# Altium schematic sheet moFOC-MCU.SchDoc
size A4; Organization: Altium Limited; Address1: L3, 12a Rodborough Rd; Address2: Frenchs Forest; Address3: NSW; Address4: Australia 2086
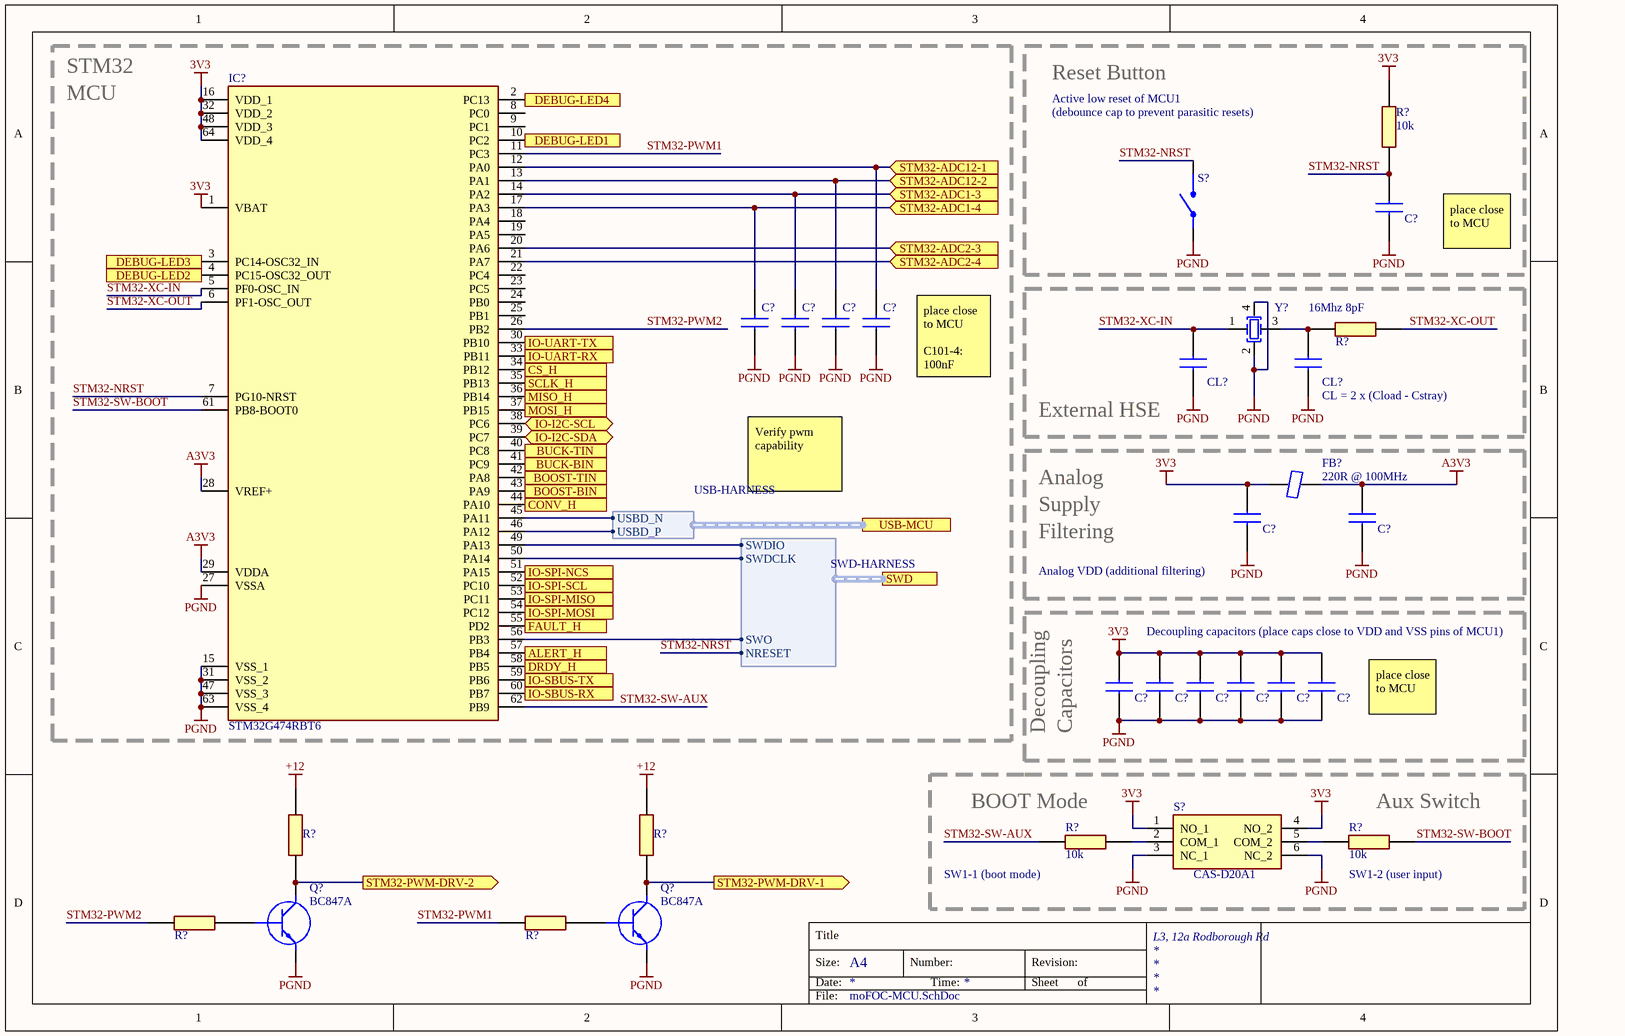
[diagram p0: moFOC-MCU.SchDoc]

## Parts
(Parts that share a designator on the sheet are numbered #1, #2 ... from top to bottom, then left to right.)
C?#1  100nF 3V3  [CAPC1608X97N]  (value not drawn)
C?#2  100nF 6.3V  [CAPC1005X55N]  (value not drawn)
C?#3  100nF 6.3V  [CAPC1005X55N]  (value not drawn)
C?#4  100nF 6.3V  [CAPC1005X55N]  (value not drawn)
C?#5  100nF 6.3V  [CAPC1005X55N]  (value not drawn)
C?#6  10nF  [CAPC1608X97N]  (value not drawn)
C?#7  10nF  [CAPC1608X97N]  (value not drawn)
C?#8  100nF 3V3  [CAPC1608X97N]  (value not drawn)
C?#9  100nF 3V3  [CAPC1608X97N]  (value not drawn)
C?#10  100nF 3V3  [CAPC1608X97N]  (value not drawn)
C?#11  100nF 3V3  [CAPC1608X97N]  (value not drawn)
C?#12  100nF 3V3  [CAPC1608X97N]  (value not drawn)
C?#13  100nF 3V3  [CAPC1608X97N]  (value not drawn)
CL?#1  4nF  [CAPC1608X97N]  (value not drawn)
CL?#2  4nF  [CAPC1608X97N]  (value not drawn)
FB?  220R @ 100MHz  [FB0603]
IC?  STM32G474RBT6  [QFP50P1200X1200X160-64N]
Q?#1  BC847A  [SOT95P230X110-3N]
Q?#2  BC847A  [SOT95P230X110-3N]
R?#1  10k  [RESC1608X50N]
R?#2  22R  [RESC1005X40N]  (value not drawn)
R?#3  10k  [RESC1608X50N]
R?#4  10k  [RESC1608X50N]
R?#5  2k  [RESC1608X50N]  (value not drawn)
R?#6  2k  [RESC1608X50N]  (value not drawn)
R?#7  1k  [RESC1608X50N]  (value not drawn)
R?#8  1k  [RESC1608X50N]  (value not drawn)
S?#1  434153017835  [434153017835]  (value not drawn)
S?#2  CAS-D20A1  [CASD20A1]
Y?  16Mhz 8pF  [ABM8W160000MHZ8B1UT3]

## Blocks framed on the sheet
Reset Button: C?#1 R?#1 S?#1
External HSE: CL?#1 CL?#2 R?#2 Y?

## Ports
ALERT_H (in), BOOST-BIN (out), BOOST-TIN (out), BUCK-BIN (out), BUCK-TIN (out), CONV_H (out), CS_H (out), DEBUG-LED1 (out), DEBUG-LED2 (out), DEBUG-LED3 (out), DEBUG-LED4 (out), DRDY_H (in), FAULT_H (in), IO-I2C-SCL (bidir), IO-I2C-SDA (bidir), IO-SBUS-RX (in), IO-SBUS-TX (out), IO-SPI-MISO (in), IO-SPI-MOSI (out), IO-SPI-NCS (out), IO-SPI-SCL (out), IO-UART-RX (in), IO-UART-TX (out), MISO_H (in), MOSI_H (out), SCLK_H (out), STM32-ADC1-3 (in), STM32-ADC1-4 (in), STM32-ADC2-3 (in), STM32-ADC2-4 (in), STM32-ADC12-1 (in), STM32-ADC12-2 (in), STM32-PWM-DRV-1 (out), STM32-PWM-DRV-2 (out), SWD (harness SWD-HARNESS), USB-MCU (harness USB-HARNESS)

## Harnesses
USB-HARNESS: USBD_P, USBD_N
SWD-HARNESS: SWDIO, SWDCLK, SWO, NRESET

## Nets
3V3: C?#6.1 C?#8.1 C?#9.1 C?#10.1 C?#11.1 C?#12.1 C?#13.1 FB?.1 IC?.1(VBAT) IC?.16(VDD_1) IC?.32(VDD_2) IC?.48(VDD_3) IC?.64(VDD_4) R?#1.1 S?#2.1(NO_1) S?#2.4(NO_2)
+12: R?#5.2 R?#6.2
A3V3: C?#7.1 FB?.2 IC?.28(VREF+) IC?.29(VDDA)
PGND: C?#1.2 C?#2.1 C?#3.1 C?#4.1 C?#5.1 C?#6.2 C?#7.2 C?#8.2 C?#9.2 C?#10.2 C?#11.2 C?#12.2 C?#13.2 CL?#1.1 CL?#2.1 IC?.15(VSS_1) IC?.27(VSSA) IC?.31(VSS_2) IC?.47(VSS_3) IC?.63(VSS_4) Q?#1.2(E) Q?#2.2(E) S?#1.1,3(NO) S?#2.3(NC_1) S?#2.6(NC_2) Y?.2(OSC2) Y?.4
ALERT_H: IC?.57(PB4) ; port ALERT_H
BOOST-BIN: IC?.43(PA9) ; port BOOST-BIN
BOOST-TIN: IC?.42(PA8) ; port BOOST-TIN
BUCK-BIN: IC?.41(PC9) ; port BUCK-BIN
BUCK-TIN: IC?.40(PC8) ; port BUCK-TIN
CONV_H: IC?.44(PA10) ; port CONV_H
CS_H: IC?.34(PB12) ; port CS_H
DEBUG-LED1: IC?.10(PC2) ; port DEBUG-LED1
DEBUG-LED2: IC?.4(PC15-OSC32_OUT) ; port DEBUG-LED2
DEBUG-LED3: IC?.3(PC14-OSC32_IN) ; port DEBUG-LED3
DEBUG-LED4: IC?.2(PC13) ; port DEBUG-LED4
DRDY_H: IC?.58(PB5) ; port DRDY_H
FAULT_H: IC?.55(PD2) ; port FAULT_H
IO-I2C-SCL: IC?.38(PC6) ; port IO-I2C-SCL
IO-I2C-SDA: IC?.39(PC7) ; port IO-I2C-SDA
IO-SBUS-RX: IC?.60(PB7) ; port IO-SBUS-RX
IO-SBUS-TX: IC?.59(PB6) ; port IO-SBUS-TX
IO-SPI-MISO: IC?.53(PC11) ; port IO-SPI-MISO
IO-SPI-MOSI: IC?.54(PC12) ; port IO-SPI-MOSI
IO-SPI-NCS: IC?.51(PA15) ; port IO-SPI-NCS
IO-SPI-SCL: IC?.52(PC10) ; port IO-SPI-SCL
IO-UART-RX: IC?.33(PB11) ; port IO-UART-RX
IO-UART-TX: IC?.30(PB10) ; port IO-UART-TX
MISO_H: IC?.36(PB14) ; port MISO_H
MOSI_H: IC?.37(PB15) ; port MOSI_H
SCLK_H: IC?.35(PB13) ; port SCLK_H
STM32-ADC1-3: C?#3.2 IC?.14(PA2) ; port STM32-ADC1-3
STM32-ADC1-4: C?#2.2 IC?.17(PA3) ; port STM32-ADC1-4
STM32-ADC2-3: IC?.20(PA6) ; port STM32-ADC2-3
STM32-ADC2-4: IC?.21(PA7) ; port STM32-ADC2-4
STM32-ADC12-1: C?#5.2 IC?.12(PA0) ; port STM32-ADC12-1
STM32-ADC12-2: C?#4.2 IC?.13(PA1) ; port STM32-ADC12-2
STM32-NRST: C?#1.1 IC?.7(PG10-NRST) R?#1.2 S?#1.2,4(COM) ; port SWD.NRESET
STM32-PWM1: IC?.11(PC3) R?#8.2
STM32-PWM2: IC?.26(PB2) R?#7.2
STM32-PWM-DRV-1: Q?#2.3(C) R?#6.1 ; port STM32-PWM-DRV-1
STM32-PWM-DRV-2: Q?#1.3(C) R?#5.1 ; port STM32-PWM-DRV-2
STM32-SW-AUX: IC?.62(PB9) R?#3.2
STM32-SW-BOOT: IC?.61(PB8-BOOT0) R?#4.2
STM32-XC-IN: CL?#1.2 IC?.5(PF0-OSC_IN) Y?.1(OSC1)
STM32-XC-OUT: IC?.6(PF1-OSC_OUT) R?#2.2
NetCL?#2_2: CL?#2.2 R?#2.1 Y?.3
NetIC?_45: IC?.45(PA11) ; port USB-MCU.USBD_N
NetIC?_46: IC?.46(PA12) ; port USB-MCU.USBD_P
NetIC?_49: IC?.49(PA13) ; port SWD.SWDIO
NetIC?_50: IC?.50(PA14) ; port SWD.SWDCLK
NetIC?_56: IC?.56(PB3) ; port SWD.SWO
NetQ?#1_1: Q?#1.1(B) R?#7.1
NetQ?#2_1: Q?#2.1(B) R?#8.1
NetR?#3_1: R?#3.1 S?#2.2(COM_1)
NetR?#4_1: R?#4.1 S?#2.5(COM_2)

Not connected (* = marked no-connect by the designer): IC? 8(PC0) 9(PC1) 18(PA4) 19(PA5) 22(PC4) 23(PC5) 24(PB0) 25(PB1)

## Notes on the sheet
- STM32
- MCU
- Active low reset of MCU1
- (debounce cap to prevent parasitic resets)
- place close to MCU
- (near C?#5) place close to MCU
  C101-4: 100nF
- (near CL?#2) CL = 2 x (Cload - Cstray)
- Verify pwm capability
- Analog
- Supply
- (near C?#6) Analog VDD (additional filtering)
- Filtering
- (near C?#9) Decoupling capacitors (place caps close to VDD and VSS pins of MCU1)
- (near C?#13) place close to MCU
- Decoupling
- (near C?#8) Capacitors
- (near R?#3) BOOT Mode
- (near R?#4) Aux Switch
- (near R?#3) SW1-1 (boot mode)
- (near R?#4) SW1-2 (user input)
- Title
- Size:
- Date:
- A4
- Number:
- Time:
- Revision:
- Sheet
- of
- File:

## Library data of the parts
C?#1 C?#6-C?#13 CL?#1 CL?#2 = C0603: Capacitor; Height: 0.97
C?#2-C?#5 = C0402: Capacitor
FB? = FB0603: Ferrite Bead; Manufacturer_Name: TDK; Manufacturer_Part_Number: MPZ1608S221ATA00; Datasheet Link: https://product.tdk.com/system/files/dam/doc/product/emc/emc/beads/catalog/beads_commercial_power_mpz1608_en.pdf; Height: 0.75mm; Mouser Part Number: 810-MPZ1608S221ATA00; Mouser Price/Stock: https://www.mouser.co.uk/ProductDetail/TDK/MPZ1608S221ATA00?qs=pLY5GE0xrmLZeKkazChaNg%3D%3D; Arrow Part Number: MPZ1608S221ATA00; Arrow Price/Stock: https://www.arrow.com/en/products/mpz1608s221ata00/tdk?region=nac
IC? = STM32G474RBT6: Integrated Circuit; Manufacturer_Name: STMicroelectronics; Datasheet Link: https://www.mouser.com/datasheet/2/389/stm32g474cb-1600828.pdf; Height: 1.6mm; Manufacturer_Part_Number: STM32G474RBT6; Mouser Part Number: 511-STM32G474RBT6; Mouser Price/Stock: https://www.mouser.co.uk/ProductDetail/STMicroelectronics/STM32G474RBT6?qs=uwxL4vQweFP0uAZUZXLBhQ%3D%3D
Q?#1 Q?#2 = BC847A,235: Transistor BJT NPN; Manufacturer_Name: Nexperia; Datasheet Link: http://assets.nexperia.com/documents/data-sheet/BC847_SER.pdf; Height: 1.1mm; Manufacturer_Part_Number: BC847A,235; Mouser Part Number: 771-BC847A235; Mouser Price/Stock: https://www.mouser.co.uk/ProductDetail/Nexperia/BC847A235?qs=me8TqzrmIYWeD%252BqPzufrRA%3D%3D; Arrow Part Number: BC847A,235; Arrow Price/Stock: https://www.arrow.com/en/products/bc847a235/nexperia
R?#1 R?#3-R?#8 = R0603: Resistor; Manufacturer_Name: Panasonic; Manufacturer_Part_Number: ERJ-PA3J104V; Datasheet Link: https://industrial.panasonic.com/cdbs/www-data/pdf/RDO0000/AOA0000C331.pdf; Height: 0.55mm; Arrow Part Number: ERJ-PA3J104V; Arrow Price/Stock: https://www.arrow.com/en/products/erj-pa3j104v/panasonic; Mouser Part Number: 667-ERJ-PA3J104V; Mouser Price/Stock: https://www.mouser.co.uk/ProductDetail/Panasonic/ERJ-PA3J104V/?qs=BzJM0faLVqV4tD3ZRAThew%3D%3D
R?#2 = R0402: Resistor; Height: 0.4mm
S?#1 = SW-SPST: Switch
S?#2 = CAS-D20A1: Switch; Manufacturer_Name: Copal Electronics; Datasheet Link: https://www.nidec-copal-electronics.com/e/catalog/switch/cas.pdf; Height: 2.5mm; Manufacturer_Part_Number: CAS-D20A1
Y? = ABM8W-16.0000MHZ-8-B1U-T3: Crystal or Oscillator; Manufacturer_Name: ABRACON; Datasheet Link: https://abracon.com/Resonators/ABM8W.pdf; Height: 0.75mm; Manufacturer_Part_Number: ABM8W-16.0000MHZ-8-B1U-T3; Mouser Part Number: 815-8W16-8B1UT; Mouser Price/Stock: https://www.mouser.co.uk/ProductDetail/ABRACON/ABM8W-160000MHZ-8-B1U-T3?qs=5aG0NVq1C4zuwTHNFUIcqw%3D%3D; Arrow Part Number: ABM8W-16.0000MHZ-8-B1U-T3; Arrow Price/Stock: https://www.arrow.com/en/products/abm8w-16.0000mhz-8-b1u-t3/abracon